# EAGLE design Traffic-tracker (EAGLE 7.6.0)
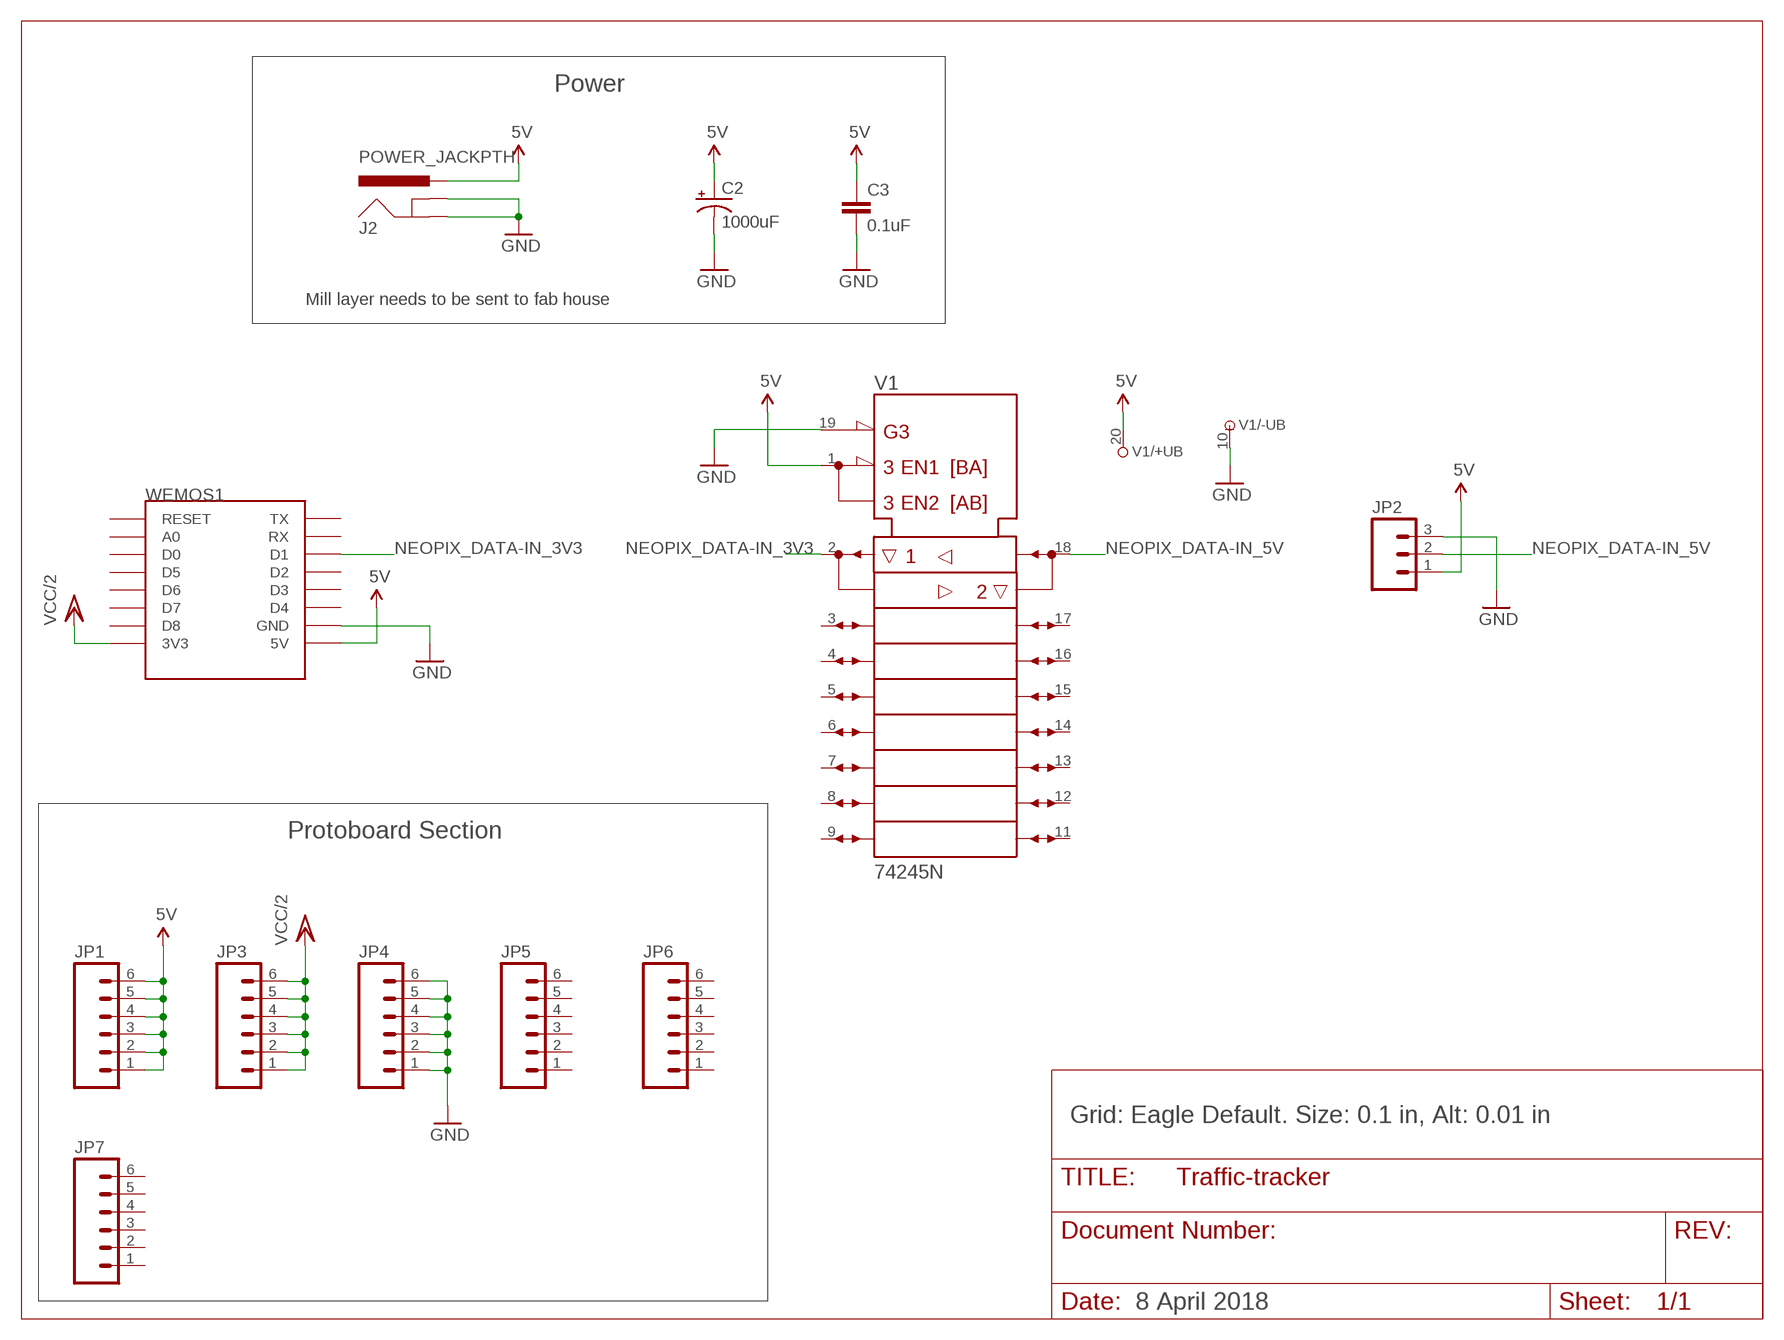
[diagram p0: schematic, sheet 1]

## Parts
C2  1000uF  CAP_POLPTH4  [CPOL-RADIAL-1000UF-25V]
C3  0.1uF  CAP0603-CAP  [0603-CAP]
J2  POWER_JACKPTH  [POWER_JACK_PTH]
JP1  M06POGOPIN_HOLES_ONLY  [1X06_HOLES_ONLY]
JP2  M03-SCREW-5MM  [SCREWTERMINAL-5MM-3]
JP3  M06POGOPIN_HOLES_ONLY  [1X06_HOLES_ONLY]
JP4  M06POGOPIN_HOLES_ONLY  [1X06_HOLES_ONLY]
JP5  M06POGOPIN_HOLES_ONLY  [1X06_HOLES_ONLY]
JP6  M06POGOPIN_HOLES_ONLY  [1X06_HOLES_ONLY]
JP7  M06POGOPIN_HOLES_ONLY  [1X06_HOLES_ONLY]
V1  74245N  [DIL20]
WEMOS1  WEMOS-D1-MINI  [WEMOS-D1-MINI]

## Nets
5V: C2.1(+) C3.1 J2.PWR JP1.1 JP1.2 JP1.3 JP1.4 JP1.5 JP1.6 JP2.1 V1.1(DIR) V1.20(+UB) WEMOS1.5V
GND: C2.2(-) C3.2 J2.GND J2.GNDBREAK JP2.3 JP4.1 JP4.2 JP4.3 JP4.4 JP4.5 JP4.6 V1.10(-UB) V1.19(!G) WEMOS1.GND
NEOPIX_DATA-IN_3V3: V1.2(A1) WEMOS1.D1
NEOPIX_DATA-IN_5V: JP2.2 V1.18(B1)
VCC/2: JP3.1 JP3.2 JP3.3 JP3.4 JP3.5 JP3.6 WEMOS1.3V3
Unconnected: JP5.1 JP5.2 JP5.3 JP5.4 JP5.5 JP5.6 JP6.1 JP6.2 JP6.3 JP6.4 JP6.5 JP6.6 JP7.1 JP7.2 JP7.3 JP7.4 JP7.5 JP7.6 V1.3(A2) V1.4(A3) V1.5(A4) V1.6(A5) V1.7(A6) V1.8(A7) V1.9(A8) V1.11(B8) V1.12(B7) V1.13(B6) V1.14(B5) V1.15(B4) V1.16(B3) V1.17(B2) WEMOS1.A0 WEMOS1.D0 WEMOS1.D2 WEMOS1.D3 WEMOS1.D4 WEMOS1.D5 WEMOS1.D6 WEMOS1.D7 WEMOS1.D8 WEMOS1.RESET WEMOS1.RX WEMOS1.TX

## Notes on the sheet
- Power
- Mill layer needs to be sent to fab house
- Protoboard Section
- Grid: Eagle Default. Size: 0.1 in, Alt: 0.01 in
- 8 April 2018

## Library data of the parts
C2 = SparkFun-Capacitors:CAP_POL: Capacitor Polarized These are standard SMD and PTH capacitors. Normally 10uF, 47uF, and 100uF in electrolytic and tantalum varieties. Always verify the external diameter of the through hole cap, it varies with capacity, voltage, and manufacturer. The EIA devices should be standard.
C3 = SparkFun:CAP: Capacitor Standard 0603 ceramic capacitor, and 0.1" leaded capacitor.
J2 = SparkFun:POWER_JACK: Power Jack This is the standard 5.5mm barrel jack for power. The PTH is the most common, proven, reliable, footprint. All others are experimental. The Slot footprint only works if the mill layer is transmitted to the PCB fab house so be warned. Spark Fun Electronics SKU : PRT-00119. Mating wall wart : TOL-00298 (and others)
JP1 JP3-JP7 = SparkFun:M06: Header 6 Standard 6-pin 0.1" header. Use with straight break away headers (SKU : PRT-00116), right angle break away headers (PRT-00553), swiss pins (PRT-00743), machine pins (PRT-00117), and female headers (PRT-00115). Molex polarized connector foot print use with SKU : PRT-08094 with associated crimp pins and housings. NOTES ON THE VARIANTS LOCK and LOCK_LONGPADS... This footprint was designed to help hold the alignment of a through-hole component (i.e. 6-pin header) while soldering it into place. You may notice that each hole has been shifted either up or down by 0.005 of an inch from it's more standard position (which is a perfectly straight line). This slight alteration caused the pins (the squares in the middle) to touch the edges of the holes. Because they are alternating, it causes a "brace" to hold the component in place. 0.005 has proven to be the perfect amount of "off-center" position when using our standard breakaway headers. Although looks a little odd when you look at the bare footprint, once you have a header in there, the alteration is very hard to notice. Also, if you push a header all the way into place, it is covered up entirely on the bottom side. This idea of altering the position of holes to aid alignment will be further integrated into the Sparkfun Library for other footprints. It can help hold any component with 3 or more connection pins.
JP2 = SparkFun:M03: Header 3 Standard 3-pin 0.1" header. Use with straight break away headers (SKU : PRT-00116), right angle break away headers (PRT-00553), swiss pins (PRT-00743), machine pins (PRT-00117), and female headers (PRT-00115). Molex polarized connector foot print use with SKU : PRT-08232 with associated crimp pins and housings.
V1 = 74ttl-din:74*245: Octal BUS TRANSCEIVER, 3-state
WEMOS1 = esp8266modules:WEMOS-D1-MINI: WeMos.cc D1 mini ESP8266 module

## Board
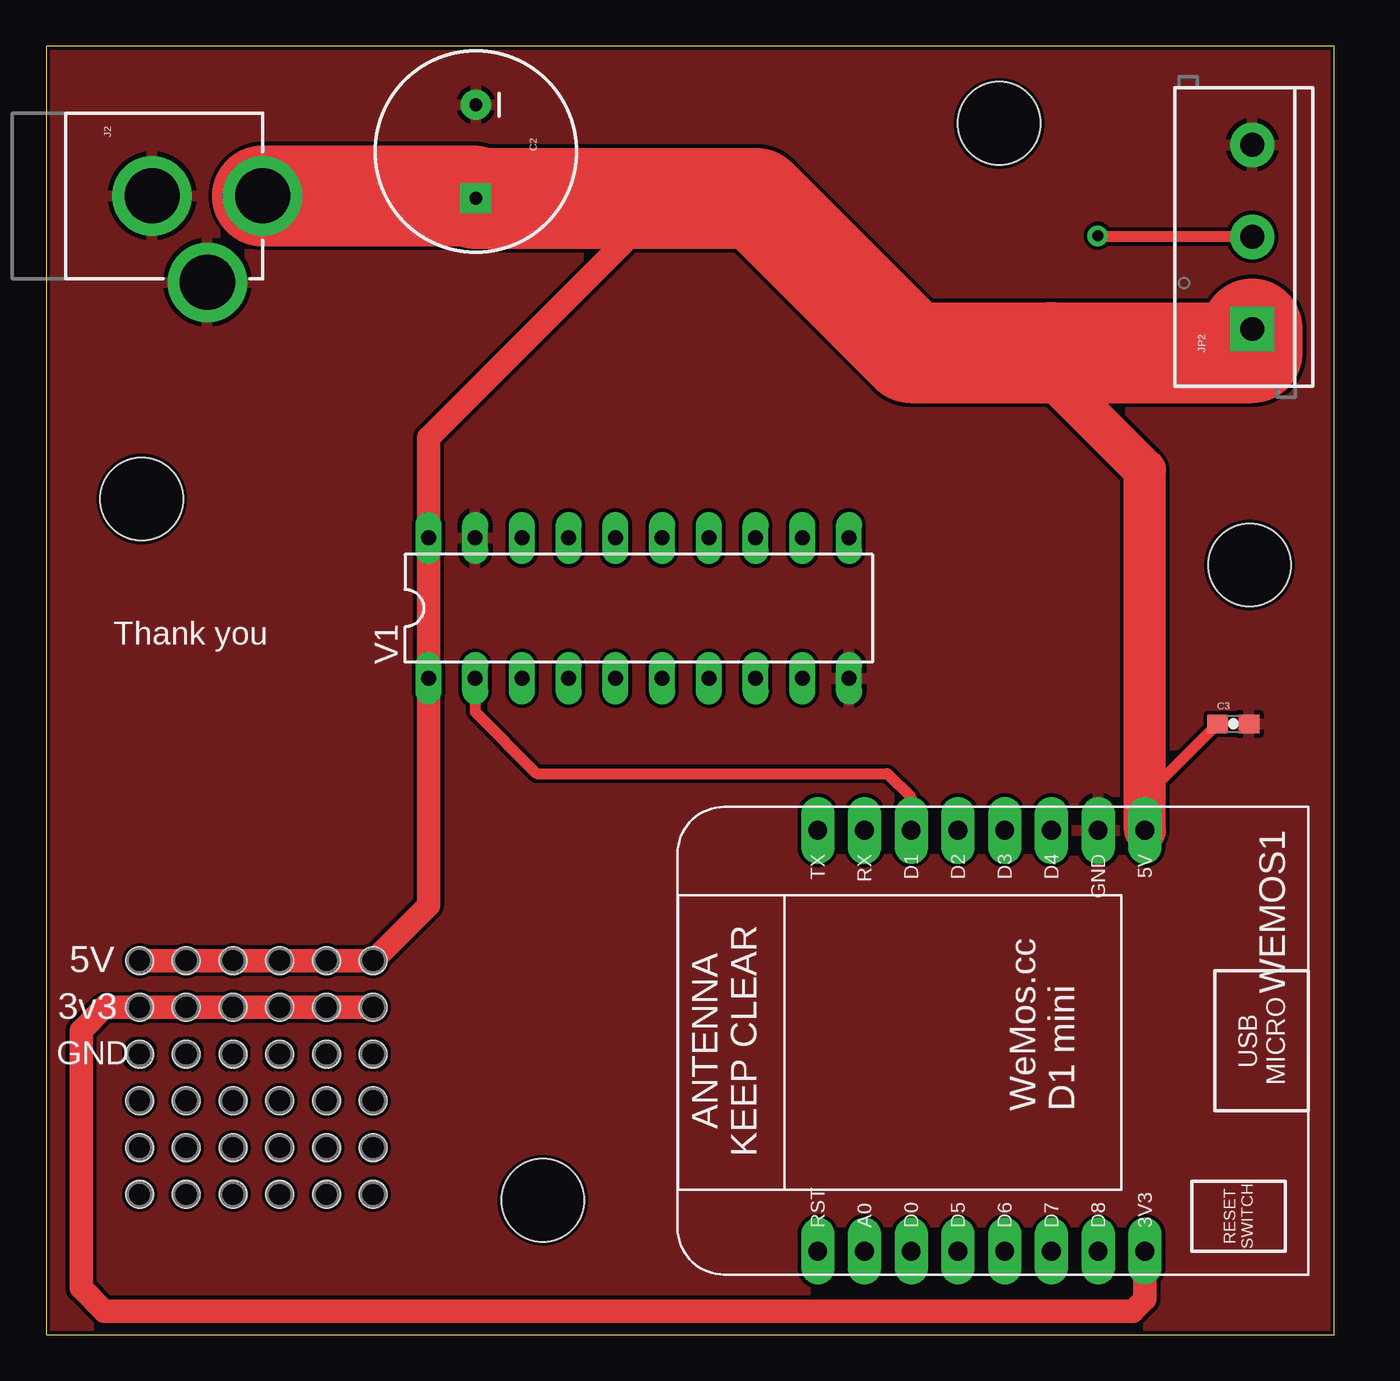
[diagram p1: board, top side]
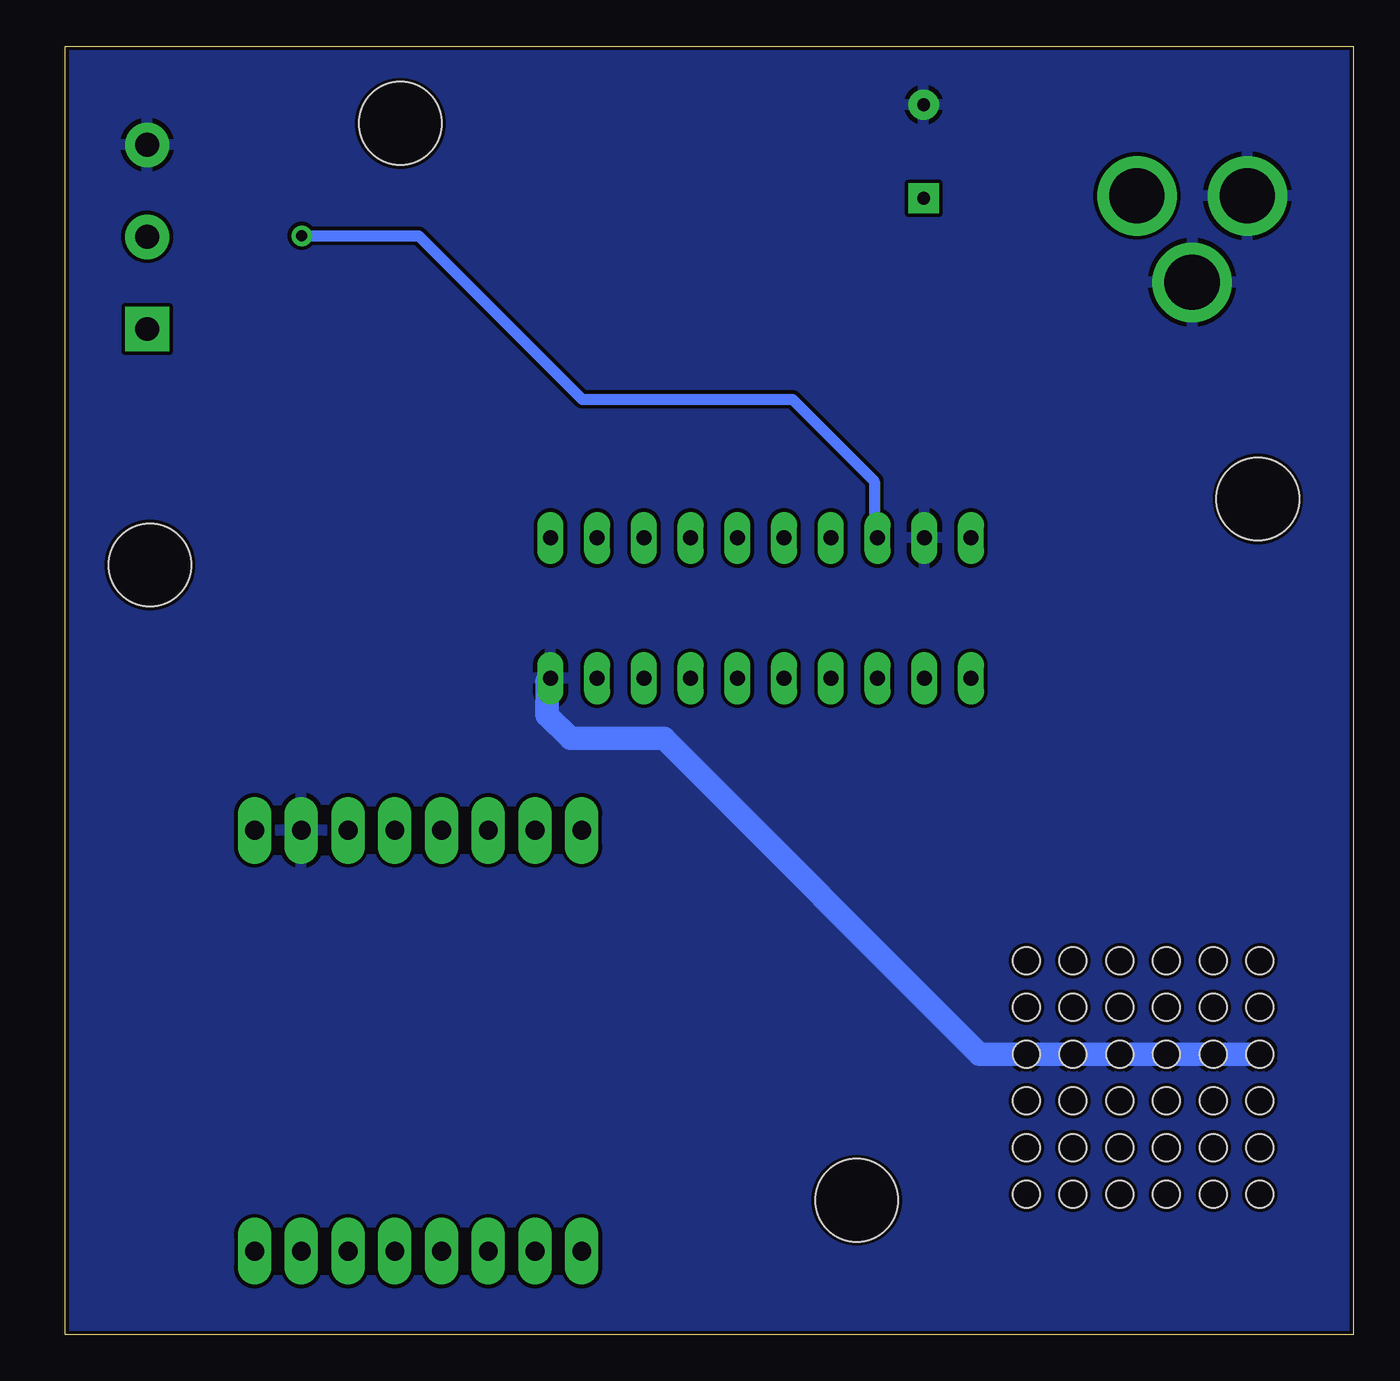
[diagram p2: board, bottom side, seen from below]

Size 70 x 70 mm. Coordinates in mm from the lower left corner, seen from the top.
Outline: 0,0 70,0 70,70 0,70 0,0
Copper layers (1*16): Top 0.035mm / dielectric 1.5mm / Bottom 0.035mm
Design rules "SparkFun": minimum track width 8mil, minimum drill 20mil, track to track 8mil, track to pad 8mil, pad to pad 8mil, via to via 8mil, smd to smd 8mil, copper to edge 8mil, drill to drill 8mil, minimum pad ring 12mil, minimum via ring 10mil, stop-mask expansion 4mil, vias tented up to drill 20mil, thermal gap 10mil
Holes 4.5 mm at 51.8,65.8 5.2,45.4 27,7.3 65.4,41.8

### Footprints (pad centres in the part's own frame; a part is rotated, then mirrored left to right if it is on the bottom)
CPOL-RADIAL-1000UF-25V = drill 0.7 pad 1.651 square: 1 2.54,0 | drill 0.7 pad 1.651: 2 -2.54,0
0603-CAP = smd 1.1 x 1: 1 -0.85,0; 2 0.85,0
POWER_JACK_PTH = drill 2.997 pad 4.318: GND 0,7.7; GNDBREAK 4.7,10.7; PWR 0,13.7
1X06_HOLES_ONLY = drill 0.889 pad 0.813: 1 0,0; 2 2.54,0; 3 5.08,0; 4 7.62,0; 5 10.16,0; 6 12.7,0 | hole 1.473: 0,0; 2.54,0; 5.08,0; 7.62,0; 10.16,0; 12.7,0
SCREWTERMINAL-5MM-3 = drill 1.3 pad 2.413 square: 1 0,0 | drill 1.3 pad 2.413: 2 5,0; 3 10,0
DIL20 = drill 0.813 long: 1 -11.43,-3.81; 2 -8.89,-3.81; 3 -6.35,-3.81; 4 -3.81,-3.81; 5 -1.27,-3.81; 6 1.27,-3.81; 7 3.81,-3.81; 8 6.35,-3.81; 9 8.89,-3.81; 10 11.43,-3.81; 11 11.43,3.81; 12 8.89,3.81; 13 6.35,3.81; 14 3.81,3.81; 15 1.27,3.81; 16 -1.27,3.81; 17 -3.81,3.81; 18 -6.35,3.81; 19 -8.89,3.81; 20 -11.43,3.81
WEMOS-D1-MINI = drill 1.016 pad 1.829 long: 3V3 -10.16,-10.16; 5V 12.7,-10.16; A0 -10.16,5.08; D0 -10.16,2.54; D1 12.7,2.54; D2 12.7,0; D3 12.7,-2.54; D4 12.7,-5.08; D5 -10.16,0; D6 -10.16,-2.54; D7 -10.16,-5.08; D8 -10.16,-7.62; GND 12.7,-7.62; RESET -10.16,7.62; RX 12.7,5.08; TX 12.7,7.62

### Placement (x,y rotation side)
C2  23.36,64.27 270 top
C3  64.52,33.18 0 top
J2  -1.93,61.86 270 top
JP1  5.08,20.32 0 top
JP2  65.55,54.63 90 top
JP3  5.08,17.78 0 top
JP4  5.08,15.24 0 top
JP5  5.08,12.7 0 top
JP6  5.08,10.16 0 top
JP7  5.08,7.62 0 top
V1  32.21,39.47 0 top
WEMOS1  49.55,14.7 90 top

### Tracks (layer width: path | path; a pad name or v marks a point on that pad's centre or on a via)
5V
  Top 0.61: WEMOS1.5V 59.72,29.23 C3.1
  Top 1.27: 31.75,61.73 31.75,59.69 20.78,48.72 V1.20 V1.1 20.78,23.32 JP1.6 JP1.5 JP1.4 JP1.3 JP1.2 JP1.1
  Top 1.93: 54.61,52.07 54.61,53.34
  Top 2.286: WEMOS1.5V 59.72,46.97 54.61,52.07
  Top 5.5: JP2.1 65.55,53.34 54.61,53.34 46.99,53.34 38.6,61.73 31.75,61.73 C2.1 23.23,61.86 J2.PWR
GND
  Bottom 1.27: V1.10 43.81,35.48 43.81,33.66 42.55,32.38 37.47,32.38 20.32,15.24 JP4.6 JP4.5 JP4.4 JP4.3 JP4.2 JP4.1
  pour Top: 0,69.85 69.85,69.85 69.85,0 0,0
  pour Bottom: 0,69.85 69.85,69.85 69.85,0 0,0
NEOPIX_DATA-IN_3V3
  Top 0.61: V1.2 23.32,33.83 26.67,30.48 45.72,30.48 46.99,29.21 46.99,27.42 WEMOS1.D1
NEOPIX_DATA-IN_5V  (via drill 0.6)
  Top 0.61: JP2.2 57.21,59.63 v57.15,59.69
  Bottom 0.61: v57.15,59.69 50.8,59.69 41.91,50.8 30.48,50.8 26.04,46.35 26.04,43.45 V1.18
VCC/2
  Top 1.27: WEMOS1.3V3 59.72,1.93 59.05,1.27 3.17,1.27 1.91,2.54 1.91,16.51 3.17,17.78 JP3.1 JP3.2 JP3.3 JP3.4 JP3.5 JP3.6

### Text on the board
tNames: Thank you | 5V | 3v3 | GND